# EasyEDA Pro project SensorPCB.epro

# Schematic Schematic1
Board Name: Board1; Create Date: 2026-04-17; Page Name: P1; Project Name: PCB_LINES_MEKATRO; Schematic Name: Schematic1; Update Date: 2026-04-17; Company: EasyEDA.com; Page Size: A4; Version: V1.0
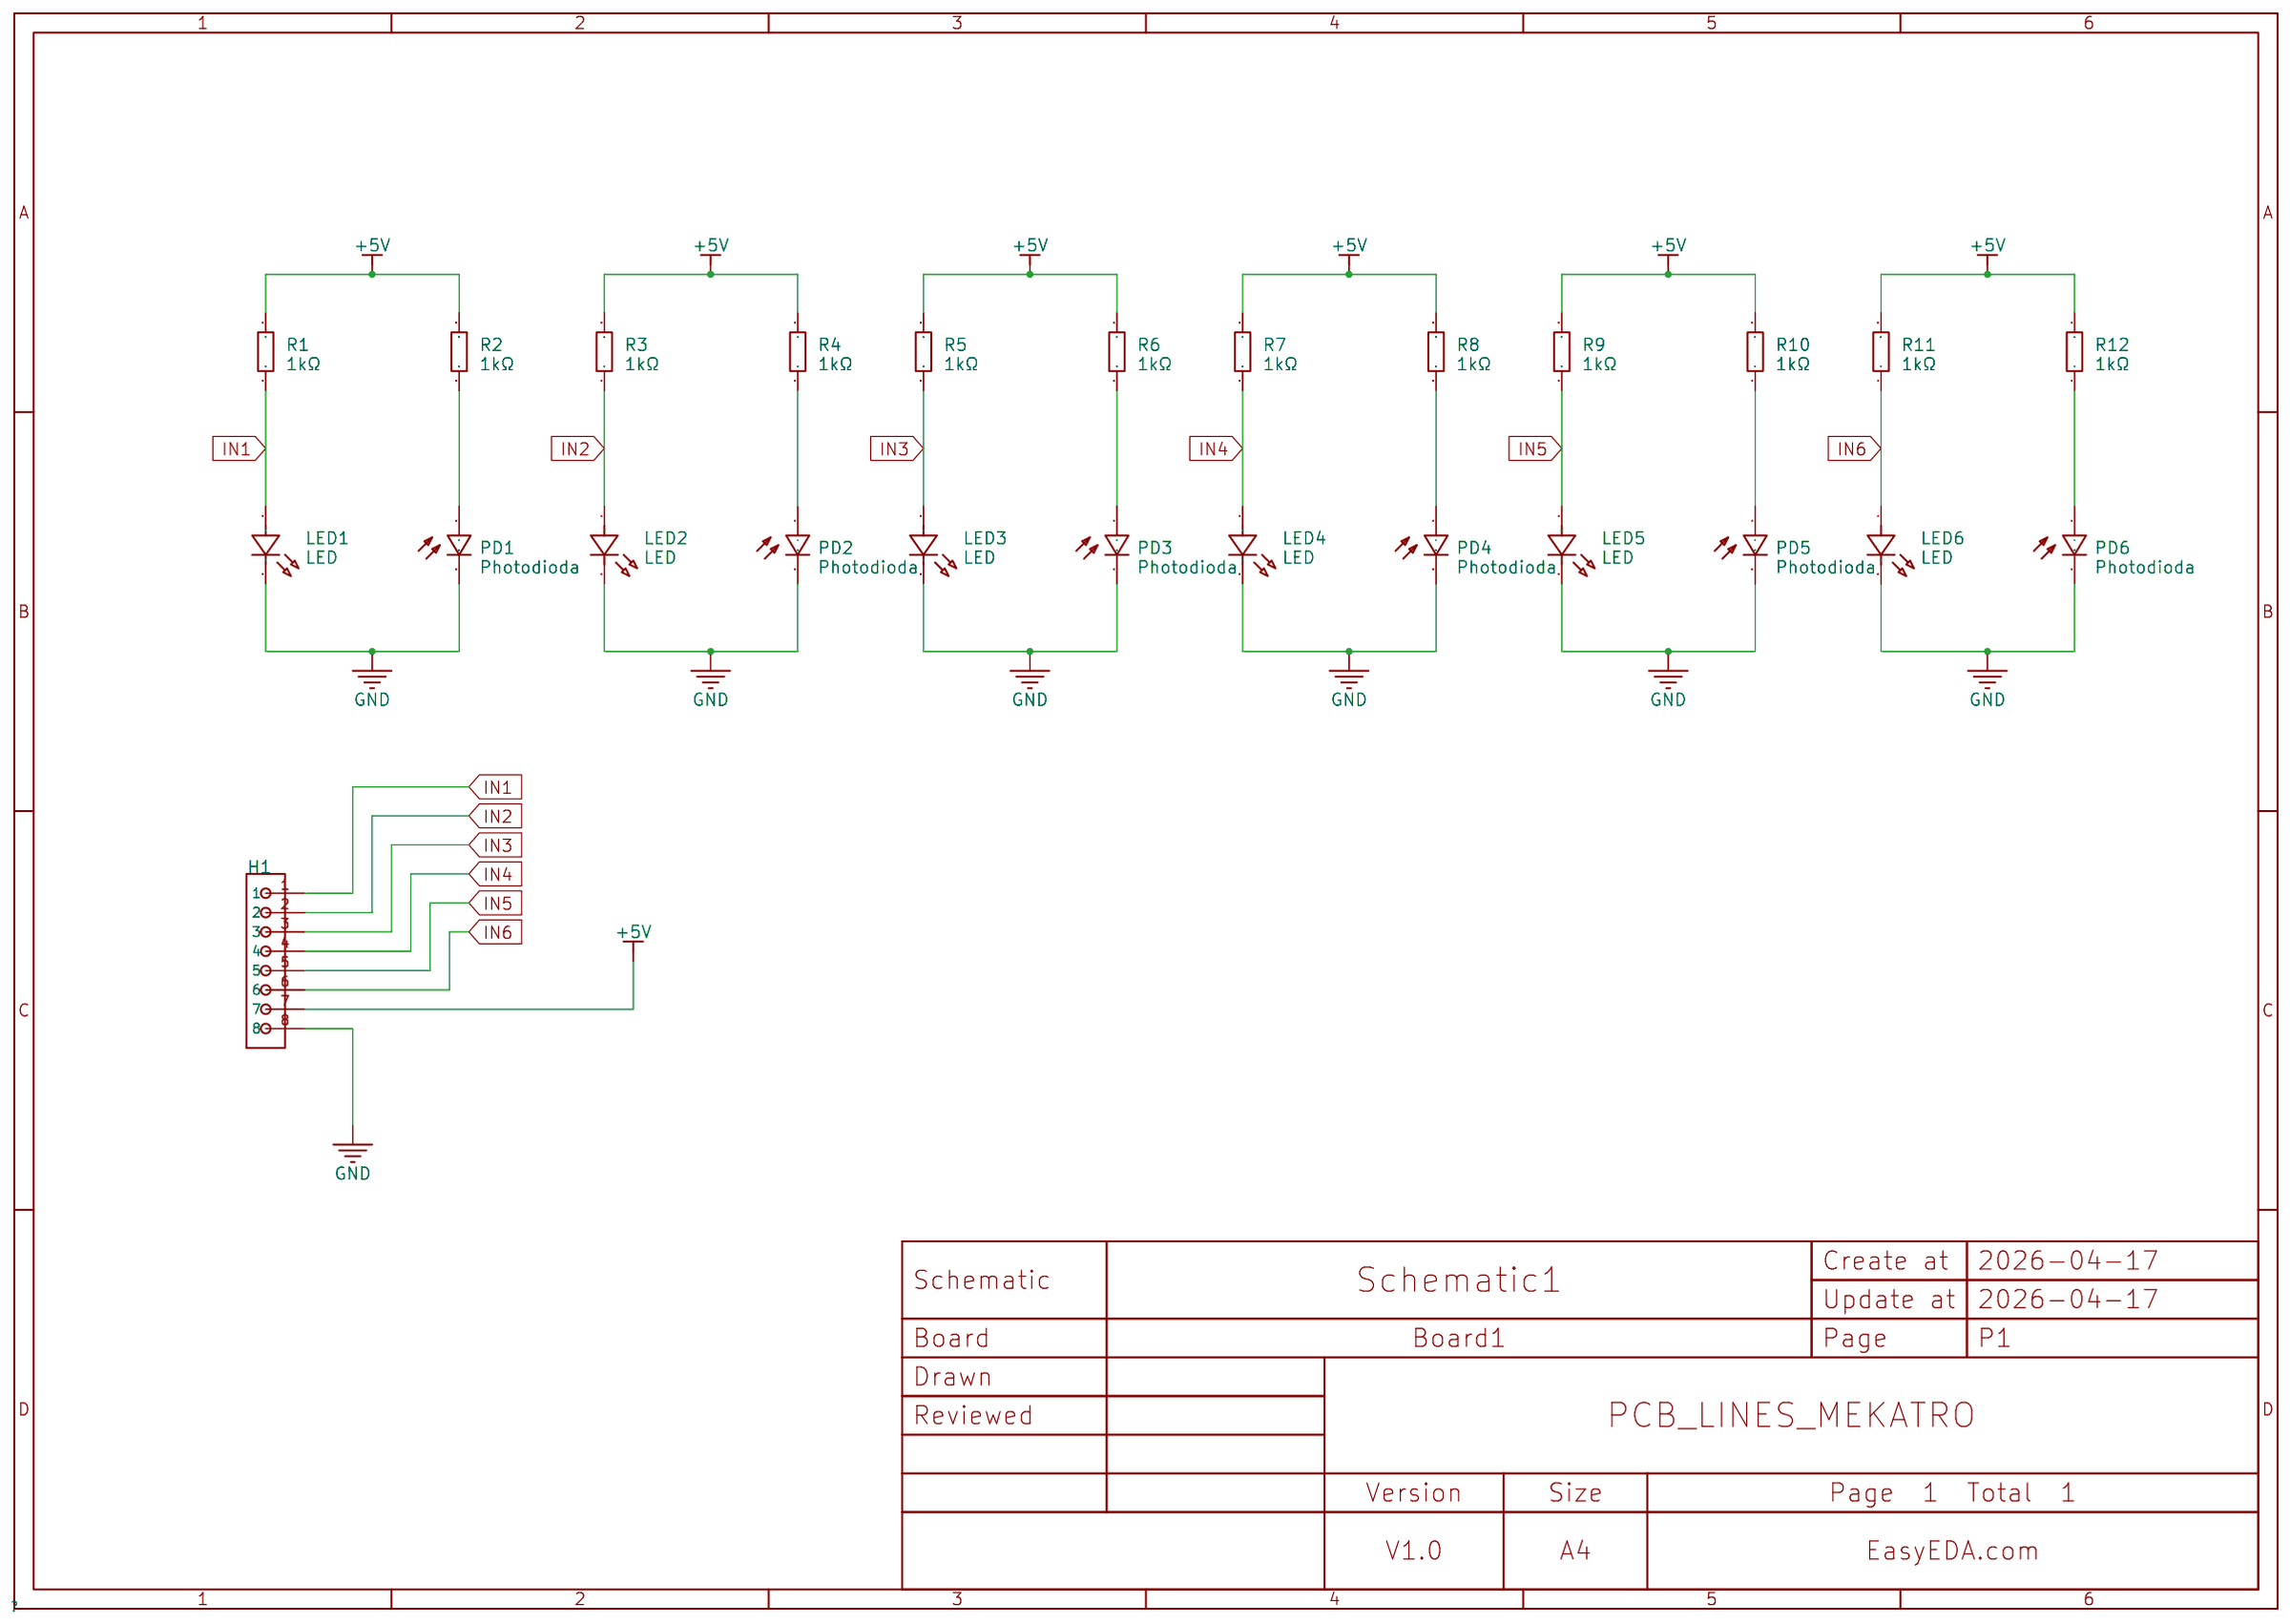
[diagram p0: schematic sheet]

## Parts
H1  -  [PIN_HEADER_1X8_MALE]
LED1  LED  [LED0603-FD]
LED2  LED  [LED0603-FD]
LED3  LED  [LED0603-FD]
LED4  LED  [LED0603-FD]
LED5  LED  [LED0603-FD]
LED6  LED  [LED0603-FD]
PD1  Photodioda  [LED-TH_BD3.5-P2.54-FD]
PD2  Photodioda  [LED-TH_BD3.5-P2.54-FD]
PD3  Photodioda  [LED-TH_BD3.5-P2.54-FD]
PD4  Photodioda  [LED-TH_BD3.5-P2.54-FD]
PD5  Photodioda  [LED-TH_BD3.5-P2.54-FD]
PD6  Photodioda  [LED-TH_BD3.5-P2.54-FD]
R1  1kΩ  [R0805]
R2  1kΩ  [R0805]
R3  1kΩ  [R0805]
R4  1kΩ  [R0805]
R5  1kΩ  [R0805]
R6  1kΩ  [R0805]
R7  1kΩ  [R0805]
R8  1kΩ  [R0805]
R9  1kΩ  [R0805]
R10  1kΩ  [R0805]
R11  1kΩ  [R0805]
R12  1kΩ  [R0805]

## Library data of the parts
H1 = pin_header_1x8_male
LED1-LED6 = 940nm_smt_led_0603: Supplier Part: C9900110607; Supplier Footprint: 0603; JLCPCB Part Class: Extended Part; Supplier: LCSC
PD1-PD6 = Photodioda: Supplier: LCSC; image: //image.lceda.cn/szlcsc/C39928.jpg
R1-R12 = 0805W8F1001T5E: LCSC Part Name: 1kΩ ±1% 125mW 厚膜电阻; Supplier Part: C17513; Manufacturer: UNI-ROYAL(厚声); Supplier Footprint: 0805; JLCPCB Part Class: Basic Part; Datasheet: https://atta.szlcsc.com/upload/public/pdf/source/20200306/C422600_1E6D84923E4A46A82E41ADD87F860B5C.pdf; Supplier: LCSC; Type: Thick Film Resistors; Tolerance: ±1%; Temperature Coefficient: ±100ppm/℃; Operating Temperature Range: -55℃~+155℃

## Nets
+5V: H1.7 R1.2 R2.2 R3.2 R4.2 R5.2 R6.2 R7.2 R8.2 R9.2 R10.2 R11.2 R12.2
GND: H1.8 LED1.2(K) LED2.2(K) LED3.2(K) LED4.2(K) LED5.2(K) LED6.2(K) PD1.2(C) PD2.2(C) PD3.2(C) PD4.2(C) PD5.2(C) PD6.2(C)
IN1: H1.1 LED1.1(A) R1.1
IN2: H1.2 LED2.1(A) R3.1
IN3: H1.3 LED3.1(A) R5.1
IN4: H1.4 LED4.1(A) R7.1
IN5: H1.5 LED5.1(A) R9.1
IN6: H1.6 LED6.1(A) R11.1
$1N533: PD1.1(A) R2.1
$1N718: PD2.1(A) R4.1
$1N889: PD3.1(A) R6.1
$1N1060: PD4.1(A) R8.1
$1N1231: PD5.1(A) R10.1
$1N1402: PD6.1(A) R12.1

# Board PCB1
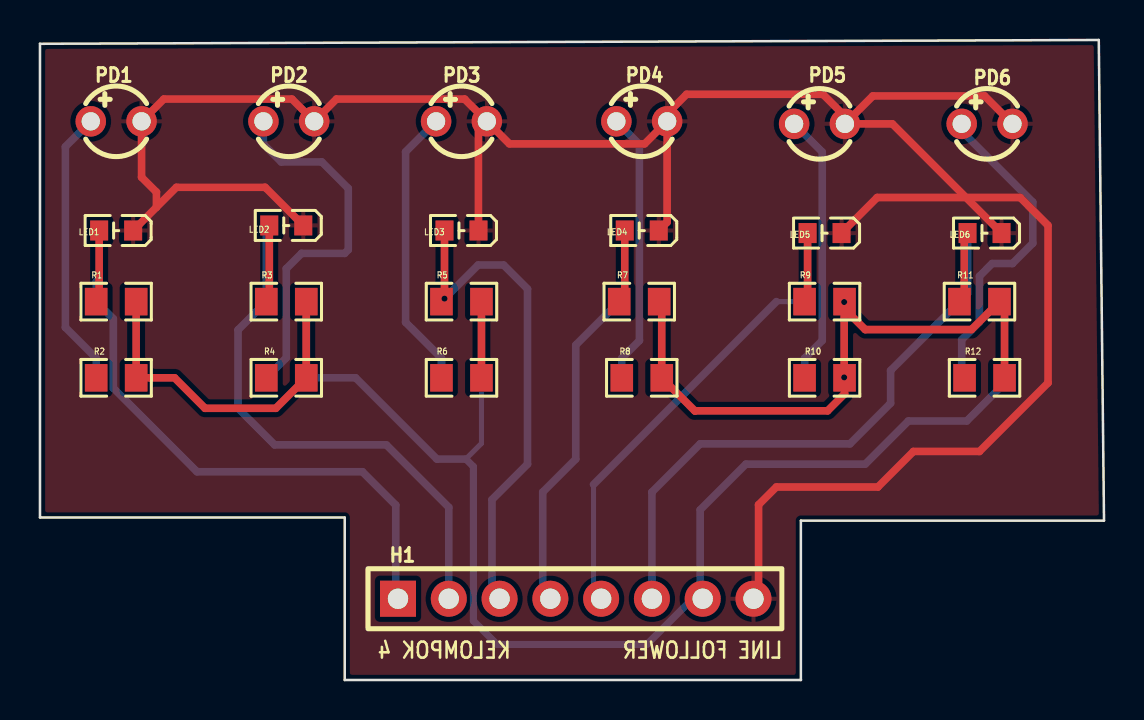
[diagram p1: board, top side]
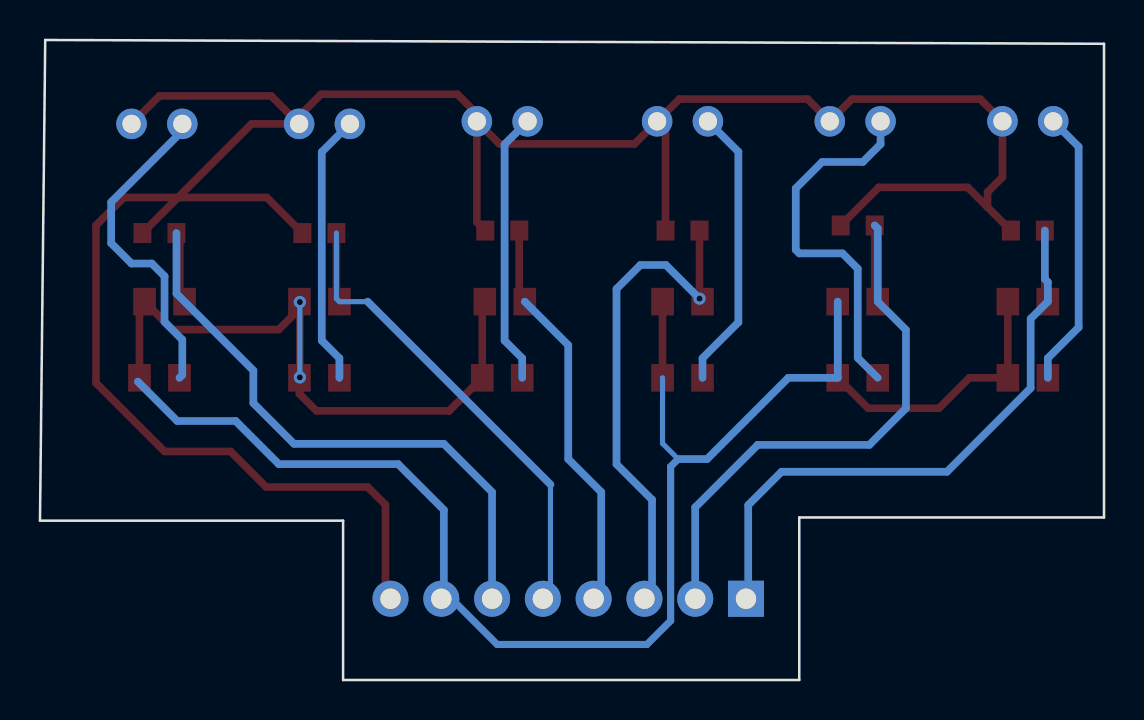
[diagram p2: board, bottom side, seen from below]

Outline 53.22 x 32.01 mm; copper layers: Top Layer, Bottom Layer. Coordinates in mm from the lower left corner of the outline.
Outline path: 0,31.82 52.96,32.01 53.22,7.97 38.06,7.97 38.06,0 15.24,0 15.24,8.13 0,8.13 0,31.82
Stack: Top Layer 0.035mm / Dielectric1 1.51mm FR4 er 4.5 / Bottom Layer 0.035mm

## Design rules (mm)
spacing copperThickness1oz (default): track to track 0.102, other pairs 0.152 to 0.3
spacing copperThickness2oz: track to track 0.203, other pairs 0.152 to 0.3
spacing Plane_innerPlane: track to track 0.102, other pairs 0.152 to 0.3
spacing Copper_copperRegion: track to track 0.102, other pairs 0.152 to 0.3
spacing Copper_copperRegion_copperThickness1oz: track to track 0.102, other pairs 0.152 to 0.3
spacing Copper_copperRegion_Copper_copperRegion: track to track 0.102, other pairs 0.152 to 0.3
track width copperThickness1oz (default): min 0.127, default 0.254, max 2.54
track width copperThickness2oz: min 0.203, default 0.254, max 2.54
differential pair differentialPair (default): width min 0.127, default 0.254, max 2.54; gap min 0.152, default 0.152
net GND uses copperRegion_copperThickness1oz
pour e289 uses Copper_copperRegion, copperRegion_Copper_copperRegion

## Placement (name value [footprint] x y rotation side)
H1  -  [PIN_HEADER_1X8_MALE]  17.91 4.06 0 top
LED1  LED  [LED0603-FD]  3.81 22.48 0 top
LED2  LED  [LED0603-FD]  12.32 22.73 0 top
LED3  LED  [LED0603-FD]  21.08 22.48 0 top
LED4  LED  [LED0603-FD]  30.1 22.48 0 top
LED5  LED  [LED0603-FD]  39.24 22.35 0 top
LED6  LED  [LED0603-FD]  47.24 22.35 0 top
PD1  Photodioda  [LED-TH_BD3.5-P2.54-FD]  3.81 27.94 0 top
PD2  Photodioda  [LED-TH_BD3.5-P2.54-FD]  12.45 27.94 0 top
PD3  Photodioda  [LED-TH_BD3.5-P2.54-FD]  21.08 27.94 0 top
PD4  Photodioda  [LED-TH_BD3.5-P2.54-FD]  30.1 27.94 0 top
PD5  Photodioda  [LED-TH_BD3.5-P2.54-FD]  38.99 27.81 0 top
PD6  Photodioda  [LED-TH_BD3.5-P2.54-FD]  47.37 27.81 0 top
R1  1kΩ  [R0805]  3.81 18.92 0 top
R2  1kΩ  [R0805]  3.81 15.11 0 top
R3  1kΩ  [R0805]  12.32 18.92 0 top
R4  1kΩ  [R0805]  12.32 15.11 0 top
R5  1kΩ  [R0805]  21.08 18.92 0 top
R6  1kΩ  [R0805]  21.08 15.11 0 top
R7  1kΩ  [R0805]  29.97 18.92 0 top
R8  1kΩ  [R0805]  30.1 15.11 0 top
R9  1kΩ  [R0805]  39.24 18.92 0 top
R10  1kΩ  [R0805]  39.24 15.11 0 top
R11  1kΩ  [R0805]  46.99 18.92 0 top
R12  1kΩ  [R0805]  47.24 15.11 0 top

## Footprints (pads in the part's own frame, mm; a bottom-side part is the same pattern mirrored in y, then rotated)
LED0603-FD
  rect 0.9x1 smd: 1(-0.85,0) 2(0.85,0)
LED-TH_BD3.5-P2.54-FD
  round 1.524 hole 0.914: 1(-1.27,0) 2(1.27,0)
PIN_HEADER_1X8_MALE
  rect 1.8x1.8 hole 1.02: 1(0,0)
  round 1.8 hole 1.02: 2(2.54,0) 3(5.08,0) 4(7.62,0) 5(10.16,0) 6(12.7,0) 7(15.24,0) 8(17.78,0)
R0805
  rect 1.133x1.377 smd: 1(-1,0) 2(1,0)

## Nets
As in the schematic.

## Via types
v1: diameter 0.61, hole 0.305, Top Layer to Bottom Layer, 3 vias

## Routing (per net, layer and track width the routed paths; a pad name or vN(x,y) marks a point on that pad's centre or on a via; arc(x,y) is an arc through that point)
+5V: length 117.8
  Top Layer w0.254: R9.2 v1(40.22,18.9) ; v1(40.22,15.13) R10.2 v1(40.22,15.13)
  Top Layer w0.381: 40.22,18.58 v1(40.22,15.13) ; 40.22,18.58 v1(40.22,18.9) ; 40.22,18.58 41.27,17.53 46.59,17.53 R11.2 48.24,18.67 R12.2 ; R3.2 R4.2 11.8,13.59 8.26,13.59 6.73,15.11 R2.2 R1.2 ; R10.2 40.24,14.31 39.39,13.46 32.77,13.46 32.76,13.45 R8.2 31.1,18.8 R7.2 ; R5.2 R6.2
  Bottom Layer w0.254: v1(40.22,18.9) v1(40.22,15.13) ; 21.3,11.05 22.08,11.83 R6.2
  Bottom Layer w0.355: 21.3,11.05 21.68,10.67 21.68,2.96 22.86,1.78 30.35,1.78 32.64,4.06 H1.7
  Bottom Layer w0.381: 48.32,14.92 46.36,12.95 43.43,12.95 41.27,10.79 35.31,10.79 33.02,8.51 33.02,4.19 H1.7 ; R3.2 R4.2 15.79,15.11 19.85,11.05 21.3,11.05
GND: length 127
  Top Layer w0.254: PD5.2 40.26,27.43
  Top Layer w0.381: 5.82,23.64 5.82,24.4 5.08,25.15 5.08,27.94 6.19,29.05 12.6,29.05 13.72,27.94 14.83,29.05 21.24,29.05 PD3.2 ; 5.82,23.64 6.82,24.64 11.26,24.64 LED2.2 ; 5.82,23.64 LED1.2 ; 46.32,24.13 41.87,24.13 LED5.2 ; 46.32,24.13 LED6.2 ; 46.32,24.13 49.02,24.13 50.42,22.73 50.42,14.86 46.99,11.43 43.69,11.43 41.91,9.65 36.83,9.65 35.94,8.76 35.94,4.32 H1.8 ; 46.32,24.13 42.63,27.81 PD5.2 ; PD5.2 41.66,29.21 47.24,29.21 PD6.2 ; PD5.2 40.26,28.19 39.16,29.29 32.34,29.29 31.37,28.32 PD4.2 ; PD3.2 21.93,27.52 LED3.2 ; PD3.2 23.48,26.81 30.24,26.81 PD4.2 ; PD4.2 31.37,22.9 LED4.2
IN1: length 33.2
  Top Layer w0.381: R1.1 2.96,19.07 2.96,22.48
  Bottom Layer w0.381: 2.96,22.48 2.96,20.05 2.81,19.9 R1.1 3.67,18.06 3.67,14.6 7.85,10.41 16.13,10.41 17.8,8.75 17.8,4.18 H1.1
IN2: length 30.8
  Top Layer w0.381: LED2.1 11.47,19.07 R3.1
  Bottom Layer w0.381: H1.2 20.45,8.64 17.32,11.76 11.74,11.76 9.91,13.59 9.91,17.51 R3.1 11.32,22.58 LED2.1
IN3: length 25.3
  Top Layer w0.254: v1(20.23,19.07) R5.1
  Top Layer w0.381: LED3.1 v1(20.23,19.07)
  Bottom Layer w0.381: v1(20.23,19.07) 21.91,20.75 23.19,20.75 24.38,19.56 24.38,10.79 22.61,9.02 22.61,4.44 H1.3
IN4: length 20.3
  Top Layer w0.381: R7.1 29.25,19.2 LED4.1
  Bottom Layer w0.381: R7.1 26.8,16.75 26.8,11.05 25.15,9.4 25.15,4.44 H1.4
IN5: length 27.2
  Top Layer w0.381: LED5.1 38.39,19.07 R9.1
  Bottom Layer w0.254: LED5.1 38.39,19.07 R9.1 36.83,18.92 ; 27.69,9.78 27.69,4.44 H1.5
  Bottom Layer w0.381: 27.69,9.78 36.83,18.92
IN6: length 32.2
  Top Layer w0.381: 46.23,21.84 46.23,19.16 R11.1
  Bottom Layer w0.381: H1.6 30.61,9.4 33.02,11.81 40.51,11.81 42.55,13.84 42.55,15.48 46.39,19.33 LED6.1
$1N533: length 14
  Bottom Layer w0.381: R2.1 2.81,16.09 1.27,17.63 1.27,26.67 PD1.1
$1N718: length 18.7
  Bottom Layer w0.381: R4.1 12.32,16.11 12.32,20.57 13.08,21.34 15.24,21.34 15.42,21.52 15.42,24.59 14.1,25.91 12.07,25.91 11.18,26.8 PD2.1
$1N889: length 14.2
  Bottom Layer w0.381: PD3.1 18.29,26.42 18.29,17.89 20.08,16.09 R6.1
$1N1060: length 13.7
  Bottom Layer w0.381: R8.1 29.1,16.09 29.98,16.98 29.98,26.79 PD4.1
$1N1231: length 13.6
  Bottom Layer w0.381: R10.1 38.24,16.09 39.13,16.98 39.13,26.41 PD5.1
$1N1402: length 16.3
  Bottom Layer w0.381: PD6.1 46.1,27.45 49.66,23.9 49.66,21.84 48.64,20.83 47.63,20.83 46.99,20.19 46.99,17.91 46.1,17.02 46.1,15.26 R12.1

## Copper pours and planes (outline as drawn; the poured copper is in the pictures)
GND on Top Layer: -3.94,34.8 55.37,34.8 55.37,-2.41 -3.94,-2.41

## Text on the board
Top Silkscreen Layer: KELOMPOK 4 | LINE FOLLOWER
